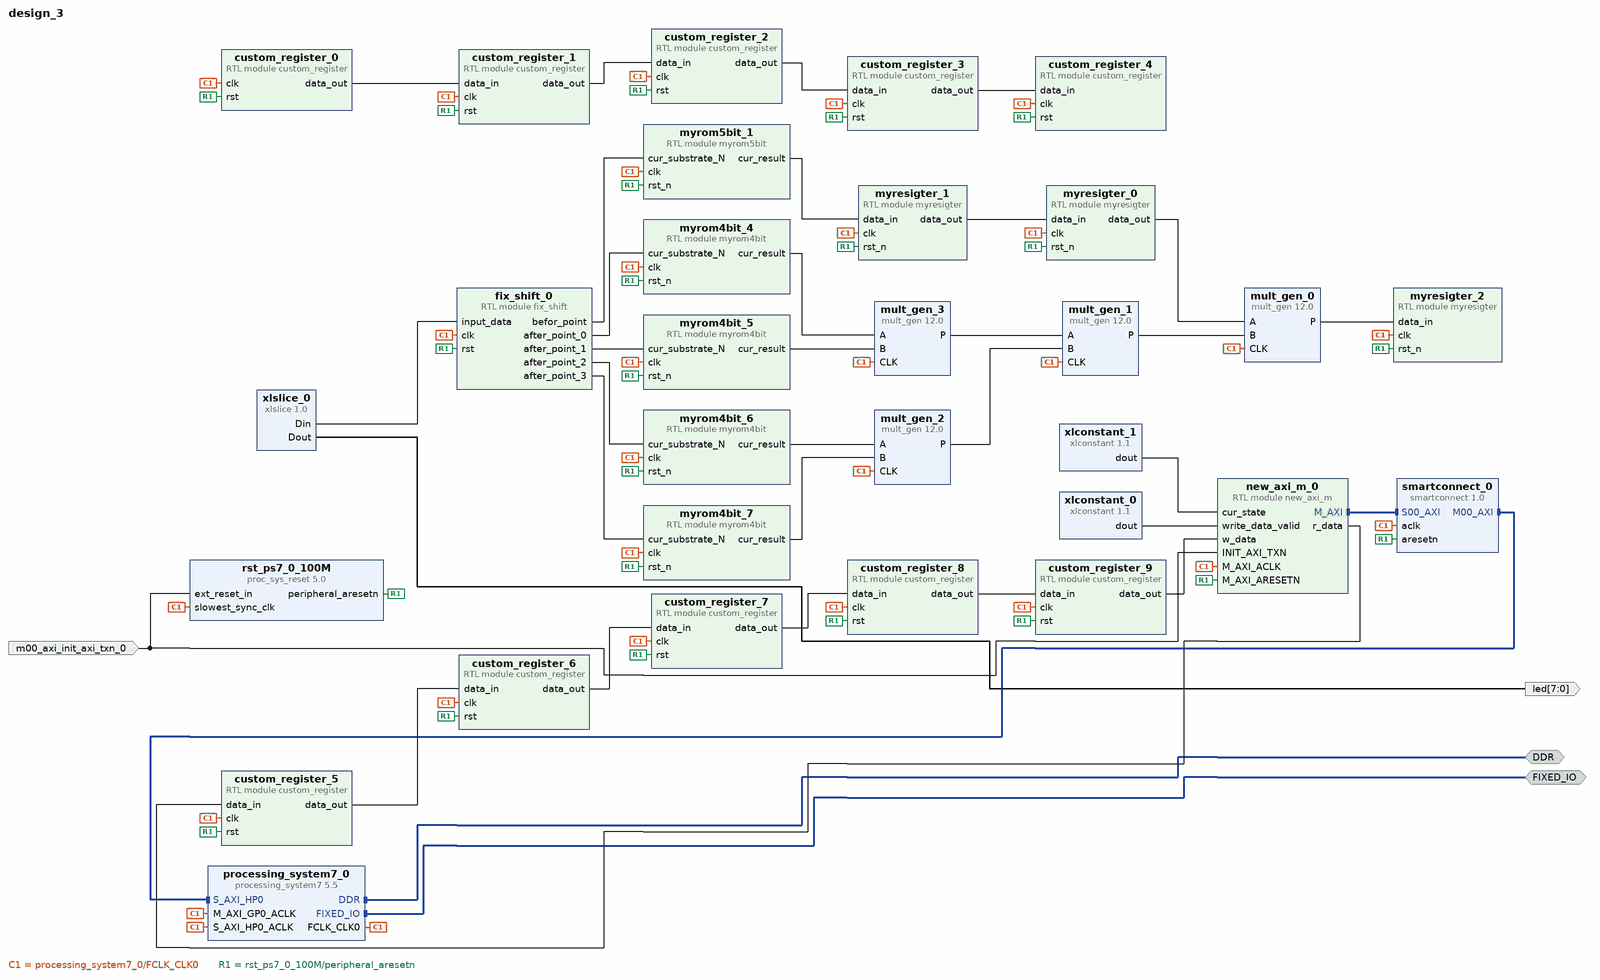
[diagram p0: block diagram of the top level]
# Vivado block design design_3, xc7z020clg484-1, Vivado 2017.4
create_bd_design design_3

create_bd_intf_port -mode Master -vlnv xilinx.com:interface:ddrx_rtl:1.0 DDR
create_bd_intf_port -mode Master -vlnv xilinx.com:display_processing_system7:fixedio_rtl:1.0 FIXED_IO
create_bd_port -dir I m00_axi_init_axi_txn_0
create_bd_port -dir O -from 7 -to 0 led

create_bd_cell -type module -reference custom_register custom_register_0
set_property -dict {CONFIG.bits 0} [get_bd_cells custom_register_0]
create_bd_cell -type module -reference custom_register custom_register_1
set_property -dict {CONFIG.bits 0} [get_bd_cells custom_register_1]
create_bd_cell -type module -reference custom_register custom_register_2
set_property -dict {CONFIG.bits 0} [get_bd_cells custom_register_2]
create_bd_cell -type module -reference custom_register custom_register_3
set_property -dict {CONFIG.bits 0} [get_bd_cells custom_register_3]
create_bd_cell -type module -reference custom_register custom_register_4
set_property -dict {CONFIG.bits 0} [get_bd_cells custom_register_4]
create_bd_cell -type ip -vlnv xilinx.com:ip:mult_gen:12.0 mult_gen_0
set_property -dict [list \
  CONFIG.PortAType Unsigned \
  CONFIG.PortAWidth 32 \
  CONFIG.PortBType Unsigned \
  CONFIG.PortBWidth 32 \
  CONFIG.Multiplier_Construction Use_Mults \
  CONFIG.OptGoal Speed \
  CONFIG.Use_Custom_Output_Width true \
  CONFIG.OutputWidthHigh 63 \
  CONFIG.OutputWidthLow 32 \
] [get_bd_cells mult_gen_0]
create_bd_cell -type ip -vlnv xilinx.com:ip:mult_gen:12.0 mult_gen_1
set_property -dict [list \
  CONFIG.PortAType Unsigned \
  CONFIG.PortAWidth 32 \
  CONFIG.PortBType Unsigned \
  CONFIG.PortBWidth 32 \
  CONFIG.Multiplier_Construction Use_Mults \
  CONFIG.OptGoal Speed \
  CONFIG.Use_Custom_Output_Width true \
  CONFIG.OutputWidthHigh 63 \
  CONFIG.OutputWidthLow 32 \
] [get_bd_cells mult_gen_1]
create_bd_cell -type ip -vlnv xilinx.com:ip:mult_gen:12.0 mult_gen_2
set_property -dict [list \
  CONFIG.PortAType Unsigned \
  CONFIG.PortAWidth 32 \
  CONFIG.PortBType Unsigned \
  CONFIG.PortBWidth 32 \
  CONFIG.Multiplier_Construction Use_Mults \
  CONFIG.OptGoal Speed \
  CONFIG.Use_Custom_Output_Width true \
  CONFIG.OutputWidthHigh 63 \
  CONFIG.OutputWidthLow 32 \
] [get_bd_cells mult_gen_2]
create_bd_cell -type ip -vlnv xilinx.com:ip:mult_gen:12.0 mult_gen_3
set_property -dict [list \
  CONFIG.PortAType Unsigned \
  CONFIG.PortAWidth 32 \
  CONFIG.PortBType Unsigned \
  CONFIG.PortBWidth 32 \
  CONFIG.Multiplier_Construction Use_Mults \
  CONFIG.OptGoal Speed \
  CONFIG.Use_Custom_Output_Width true \
  CONFIG.OutputWidthHigh 63 \
  CONFIG.OutputWidthLow 32 \
] [get_bd_cells mult_gen_3]
create_bd_cell -type module -reference myresigter myresigter_0
create_bd_cell -type module -reference myresigter myresigter_1
create_bd_cell -type module -reference myresigter myresigter_2
create_bd_cell -type ip -vlnv xilinx.com:ip:processing_system7:5.5 processing_system7_0
set_property -dict [list \
  CONFIG.PCW_UIPARAM_DDR_FREQ_MHZ 533.333333 \
  CONFIG.PCW_APU_PERIPHERAL_FREQMHZ 666.666666 \
  CONFIG.PCW_UART_PERIPHERAL_FREQMHZ 100 \
  CONFIG.PCW_FPGA0_PERIPHERAL_FREQMHZ 10 \
  CONFIG.PCW_FPGA1_PERIPHERAL_FREQMHZ 50 \
  CONFIG.PCW_USE_S_AXI_HP0 1 \
  CONFIG.PCW_S_AXI_HP0_DATA_WIDTH 32 \
  CONFIG.PCW_PERIPHERAL_BOARD_PRESET None \
  CONFIG.PCW_PRESET_BANK1_VOLTAGE {LVCMOS 3.3V} \
  CONFIG.PCW_UIPARAM_DDR_PARTNO {MT41K128M16 JT-125} \
  CONFIG.PCW_QSPI_PERIPHERAL_ENABLE 0 \
  CONFIG.PCW_ENET0_PERIPHERAL_ENABLE 0 \
  CONFIG.PCW_SD0_PERIPHERAL_ENABLE 0 \
  CONFIG.PCW_UART1_PERIPHERAL_ENABLE 1 \
  CONFIG.PCW_UART1_UART1_IO {MIO 48 .. 49} \
  CONFIG.PCW_USB0_PERIPHERAL_ENABLE 0 \
  CONFIG.PCW_GPIO_MIO_GPIO_ENABLE 0 \
] [get_bd_cells processing_system7_0]
# 339 more settings of processing_system7_0 are not shown: defaults, MIO pin electricals, DDR timing, and values the tool derives
create_bd_cell -type ip -vlnv xilinx.com:ip:proc_sys_reset:5.0 rst_ps7_0_100M
create_bd_cell -type ip -vlnv xilinx.com:ip:smartconnect:1.0 smartconnect_0
set_property -dict {CONFIG.NUM_SI 1} [get_bd_cells smartconnect_0]
create_bd_cell -type ip -vlnv xilinx.com:ip:xlconstant:1.1 xlconstant_1
set_property -dict {CONFIG.CONST_WIDTH 2 CONFIG.CONST_VAL 01} [get_bd_cells xlconstant_1]
create_bd_cell -type ip -vlnv xilinx.com:ip:xlslice:1.0 xlslice_0
set_property -dict {CONFIG.DIN_FROM 7 CONFIG.DOUT_WIDTH 8} [get_bd_cells xlslice_0]
create_bd_cell -type module -reference custom_register custom_register_5
set_property -dict {CONFIG.bits 31} [get_bd_cells custom_register_5]
create_bd_cell -type module -reference custom_register custom_register_6
set_property -dict {CONFIG.bits 31} [get_bd_cells custom_register_6]
create_bd_cell -type module -reference custom_register custom_register_7
set_property -dict {CONFIG.bits 31} [get_bd_cells custom_register_7]
create_bd_cell -type module -reference custom_register custom_register_8
set_property -dict {CONFIG.bits 31} [get_bd_cells custom_register_8]
create_bd_cell -type module -reference custom_register custom_register_9
set_property -dict {CONFIG.bits 31} [get_bd_cells custom_register_9]
create_bd_cell -type ip -vlnv xilinx.com:ip:xlconstant:1.1 xlconstant_0
create_bd_cell -type module -reference myrom4bit myrom4bit_4
set_property -dict [list \
  CONFIG.RESULT_00 0x0000 \
  CONFIG.RESULT_01 0x0000 \
  CONFIG.RESULT_02 0x0000 \
  CONFIG.RESULT_03 0x0000 \
  CONFIG.RESULT_04 0x0000 \
  CONFIG.RESULT_05 0x0000 \
  CONFIG.RESULT_06 0x0000 \
  CONFIG.RESULT_07 0x0000 \
  CONFIG.RESULT_08 0x0000 \
  CONFIG.RESULT_09 0x0000 \
  CONFIG.RESULT_10 0x0000 \
  CONFIG.RESULT_11 0x0000 \
  CONFIG.RESULT_12 0x0000 \
  CONFIG.RESULT_13 0x0000 \
  CONFIG.RESULT_14 0x0000 \
  CONFIG.RESULT_15 0x0000 \
] [get_bd_cells myrom4bit_4]
create_bd_cell -type module -reference myrom4bit myrom4bit_5
set_property -dict [list \
  CONFIG.RESULT_00 0x0000 \
  CONFIG.RESULT_01 0x0000 \
  CONFIG.RESULT_02 0x0000 \
  CONFIG.RESULT_03 0x0000 \
  CONFIG.RESULT_04 0x0000 \
  CONFIG.RESULT_05 0x0000 \
  CONFIG.RESULT_06 0x0000 \
  CONFIG.RESULT_07 0x0000 \
  CONFIG.RESULT_08 0x0000 \
  CONFIG.RESULT_09 0x0000 \
  CONFIG.RESULT_10 0x0000 \
  CONFIG.RESULT_11 0x0000 \
  CONFIG.RESULT_12 0x0000 \
  CONFIG.RESULT_13 0x0000 \
  CONFIG.RESULT_14 0x0000 \
  CONFIG.RESULT_15 0x0000 \
] [get_bd_cells myrom4bit_5]
create_bd_cell -type module -reference myrom4bit myrom4bit_6
set_property -dict [list \
  CONFIG.RESULT_00 0x0000 \
  CONFIG.RESULT_01 0x0000 \
  CONFIG.RESULT_02 0x0000 \
  CONFIG.RESULT_03 0x0000 \
  CONFIG.RESULT_04 0x0000 \
  CONFIG.RESULT_05 0x0000 \
  CONFIG.RESULT_06 0x0000 \
  CONFIG.RESULT_07 0x0000 \
  CONFIG.RESULT_08 0x0000 \
  CONFIG.RESULT_09 0x0000 \
  CONFIG.RESULT_10 0x0000 \
  CONFIG.RESULT_11 0x0000 \
  CONFIG.RESULT_12 0x0000 \
  CONFIG.RESULT_13 0x0000 \
  CONFIG.RESULT_14 0x0000 \
  CONFIG.RESULT_15 0x0000 \
] [get_bd_cells myrom4bit_6]
create_bd_cell -type module -reference myrom4bit myrom4bit_7
set_property -dict [list \
  CONFIG.RESULT_00 0x0000 \
  CONFIG.RESULT_01 0x0000 \
  CONFIG.RESULT_02 0x0000 \
  CONFIG.RESULT_03 0x0000 \
  CONFIG.RESULT_04 0x0000 \
  CONFIG.RESULT_05 0x0000 \
  CONFIG.RESULT_06 0x0000 \
  CONFIG.RESULT_07 0x0000 \
  CONFIG.RESULT_08 0x0000 \
  CONFIG.RESULT_09 0x0000 \
  CONFIG.RESULT_10 0x0000 \
  CONFIG.RESULT_11 0x0000 \
  CONFIG.RESULT_12 0x0000 \
  CONFIG.RESULT_13 0x0000 \
  CONFIG.RESULT_14 0x0000 \
  CONFIG.RESULT_15 0x0000 \
] [get_bd_cells myrom4bit_7]
create_bd_cell -type module -reference myrom5bit myrom5bit_1
set_property -dict [list \
  CONFIG.RESULT_00 0x0000 \
  CONFIG.RESULT_01 0x0000 \
  CONFIG.RESULT_02 0x0000 \
  CONFIG.RESULT_03 0x0000 \
  CONFIG.RESULT_04 0x0000 \
  CONFIG.RESULT_05 0x0000 \
  CONFIG.RESULT_06 0x0000 \
  CONFIG.RESULT_07 0x0000 \
  CONFIG.RESULT_08 0x0000 \
  CONFIG.RESULT_09 0x0000 \
  CONFIG.RESULT_10 0x0000 \
  CONFIG.RESULT_11 0x8C1A \
  CONFIG.RESULT_12 0x338A \
  CONFIG.RESULT_13 0x12F6 \
  CONFIG.RESULT_14 0x06F9 \
  CONFIG.RESULT_15 0x0290 \
  CONFIG.RESULT_16 0x00F1 \
  CONFIG.RESULT_17 0x0058 \
  CONFIG.RESULT_18 0x0020 \
  CONFIG.RESULT_19 0x000C \
  CONFIG.RESULT_20 0x0004 \
  CONFIG.RESULT_21 0x0001 \
  CONFIG.RESULT_22 0x0000 \
  CONFIG.RESULT_23 0x0000 \
  CONFIG.RESULT_24 0x0000 \
  CONFIG.RESULT_25 0x0000 \
  CONFIG.RESULT_26 0x0000 \
  CONFIG.RESULT_27 0x0000 \
  CONFIG.RESULT_28 0x0000 \
  CONFIG.RESULT_29 0x0000 \
  CONFIG.RESULT_30 0x0000 \
  CONFIG.RESULT_31 0x0000 \
] [get_bd_cells myrom5bit_1]
create_bd_cell -type module -reference fix_shift fix_shift_0
create_bd_cell -type module -reference new_axi_m new_axi_m_0
set_property -dict {CONFIG.C_M_START_DATA_VALUE 0x00000000} [get_bd_cells new_axi_m_0]

# ---- connections ----

connect_bd_intf_net [get_bd_intf_pins new_axi_m_0/M_AXI] [get_bd_intf_pins smartconnect_0/S00_AXI]
connect_bd_intf_net [get_bd_intf_pins smartconnect_0/M00_AXI] [get_bd_intf_pins processing_system7_0/S_AXI_HP0]
connect_bd_intf_net [get_bd_intf_ports DDR] [get_bd_intf_pins processing_system7_0/DDR]
connect_bd_intf_net [get_bd_intf_ports FIXED_IO] [get_bd_intf_pins processing_system7_0/FIXED_IO]
connect_bd_net -net clk_0_1 [get_bd_pins processing_system7_0/FCLK_CLK0] \
  [get_bd_pins processing_system7_0/M_AXI_GP0_ACLK] [get_bd_pins processing_system7_0/S_AXI_HP0_ACLK] \
  [get_bd_pins smartconnect_0/aclk] [get_bd_pins rst_ps7_0_100M/slowest_sync_clk] [get_bd_pins myresigter_1/clk] \
  [get_bd_pins myresigter_0/clk] [get_bd_pins mult_gen_3/CLK] [get_bd_pins mult_gen_2/CLK] [get_bd_pins mult_gen_1/CLK] \
  [get_bd_pins mult_gen_0/CLK] [get_bd_pins myresigter_2/clk] [get_bd_pins custom_register_0/clk] \
  [get_bd_pins custom_register_1/clk] [get_bd_pins custom_register_2/clk] [get_bd_pins custom_register_3/clk] \
  [get_bd_pins custom_register_4/clk] [get_bd_pins custom_register_5/clk] [get_bd_pins custom_register_6/clk] \
  [get_bd_pins custom_register_7/clk] [get_bd_pins custom_register_8/clk] [get_bd_pins custom_register_9/clk] \
  [get_bd_pins myrom4bit_4/clk] [get_bd_pins myrom4bit_5/clk] [get_bd_pins myrom4bit_6/clk] [get_bd_pins myrom4bit_7/clk] \
  [get_bd_pins myrom5bit_1/clk] [get_bd_pins fix_shift_0/clk] [get_bd_pins new_axi_m_0/M_AXI_ACLK]
connect_bd_net [get_bd_pins custom_register_0/data_out] [get_bd_pins custom_register_1/data_in]
connect_bd_net [get_bd_pins custom_register_1/data_out] [get_bd_pins custom_register_2/data_in]
connect_bd_net [get_bd_pins custom_register_2/data_out] [get_bd_pins custom_register_3/data_in]
connect_bd_net [get_bd_pins custom_register_3/data_out] [get_bd_pins custom_register_4/data_in]
connect_bd_net [get_bd_pins fix_shift_0/after_point_0] [get_bd_pins myrom4bit_4/cur_substrate_N]
connect_bd_net [get_bd_pins fix_shift_0/after_point_1] [get_bd_pins myrom4bit_5/cur_substrate_N]
connect_bd_net [get_bd_pins fix_shift_0/after_point_2] [get_bd_pins myrom4bit_6/cur_substrate_N]
connect_bd_net [get_bd_pins fix_shift_0/after_point_3] [get_bd_pins myrom4bit_7/cur_substrate_N]
connect_bd_net [get_bd_pins fix_shift_0/befor_point] [get_bd_pins myrom5bit_1/cur_substrate_N]
connect_bd_net -net m00_axi_init_axi_txn_0_1 [get_bd_ports m00_axi_init_axi_txn_0] \
  [get_bd_pins rst_ps7_0_100M/ext_reset_in] [get_bd_pins new_axi_m_0/INIT_AXI_TXN]
connect_bd_net [get_bd_pins mult_gen_0/P] [get_bd_pins myresigter_2/data_in]
connect_bd_net [get_bd_pins mult_gen_1/P] [get_bd_pins mult_gen_0/B]
connect_bd_net [get_bd_pins mult_gen_2/P] [get_bd_pins mult_gen_1/B]
connect_bd_net [get_bd_pins mult_gen_3/P] [get_bd_pins mult_gen_1/A]
connect_bd_net [get_bd_pins myresigter_0/data_out] [get_bd_pins mult_gen_0/A]
connect_bd_net [get_bd_pins myresigter_1/data_out] [get_bd_pins myresigter_0/data_in]
connect_bd_net [get_bd_pins myrom4bit_4/cur_result] [get_bd_pins mult_gen_3/A]
connect_bd_net [get_bd_pins myrom4bit_5/cur_result] [get_bd_pins mult_gen_3/B]
connect_bd_net [get_bd_pins myrom4bit_6/cur_result] [get_bd_pins mult_gen_2/A]
connect_bd_net [get_bd_pins myrom4bit_7/cur_result] [get_bd_pins mult_gen_2/B]
connect_bd_net [get_bd_pins myrom5bit_1/cur_result] [get_bd_pins myresigter_1/data_in]
connect_bd_net -net new_axi_m_0_r_data [get_bd_pins xlslice_0/Din] [get_bd_pins fix_shift_0/input_data]
connect_bd_net [get_bd_pins rst_ps7_0_100M/peripheral_aresetn] \
  [get_bd_pins smartconnect_0/aresetn] [get_bd_pins myresigter_1/rst_n] [get_bd_pins myresigter_0/rst_n] \
  [get_bd_pins myresigter_2/rst_n] [get_bd_pins custom_register_0/rst] [get_bd_pins custom_register_1/rst] \
  [get_bd_pins custom_register_2/rst] [get_bd_pins custom_register_3/rst] [get_bd_pins custom_register_4/rst] \
  [get_bd_pins custom_register_5/rst] [get_bd_pins custom_register_6/rst] [get_bd_pins custom_register_7/rst] \
  [get_bd_pins custom_register_8/rst] [get_bd_pins custom_register_9/rst] [get_bd_pins myrom4bit_4/rst_n] \
  [get_bd_pins myrom4bit_5/rst_n] [get_bd_pins myrom4bit_6/rst_n] [get_bd_pins myrom4bit_7/rst_n] \
  [get_bd_pins myrom5bit_1/rst_n] [get_bd_pins fix_shift_0/rst] [get_bd_pins new_axi_m_0/M_AXI_ARESETN]
connect_bd_net [get_bd_pins xlconstant_1/dout] [get_bd_pins new_axi_m_0/cur_state]
connect_bd_net [get_bd_pins xlslice_0/Dout] [get_bd_ports led]
connect_bd_net [get_bd_pins new_axi_m_0/r_data] [get_bd_pins custom_register_5/data_in]
connect_bd_net [get_bd_pins custom_register_5/data_out] [get_bd_pins custom_register_6/data_in]
connect_bd_net [get_bd_pins custom_register_6/data_out] [get_bd_pins custom_register_7/data_in]
connect_bd_net [get_bd_pins custom_register_7/data_out] [get_bd_pins custom_register_8/data_in]
connect_bd_net [get_bd_pins custom_register_8/data_out] [get_bd_pins custom_register_9/data_in]
connect_bd_net [get_bd_pins custom_register_9/data_out] [get_bd_pins new_axi_m_0/w_data]
connect_bd_net [get_bd_pins xlconstant_0/dout] [get_bd_pins new_axi_m_0/write_data_valid]

validate_bd_design
save_bd_design
